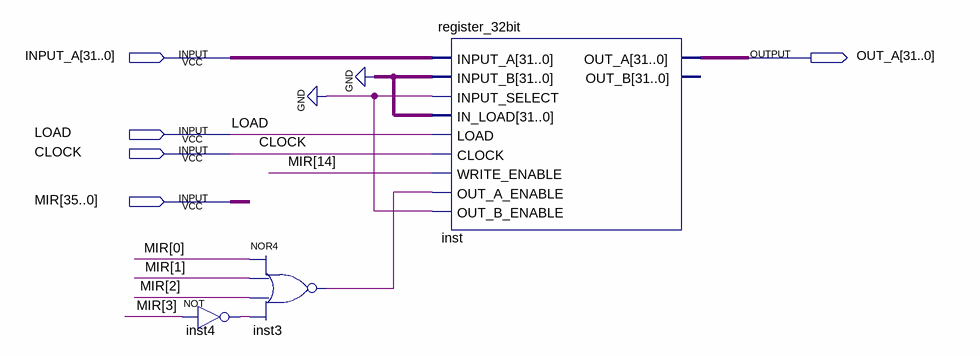
[diagram p0: schematic sheet]
// Quartus schematic OPC.bdf as structural Verilog: 3 symbols, 5 pins
module OPC (
  input  [31:0] INPUT_A,
  input  LOAD,
  input  CLOCK,
  input  [35:0] MIR,
  output [31:0] OUT_A
);

  wire inst3_out, inst4_out;

  not inst4 (inst4_out, MIR[3]);
  nor inst3 (inst3_out, MIR[0], MIR[1], MIR[2], inst4_out);
  register_32bit inst (
    .INPUT_A(INPUT_A), .INPUT_B({32{1'b0}}), .INPUT_SELECT(1'b0), .IN_LOAD({32{1'b0}}), .LOAD(LOAD),
    .CLOCK(CLOCK), .WRITE_ENABLE(MIR[14]), .OUT_A_ENABLE(inst3_out), .OUT_B_ENABLE(1'b0), .OUT_A(OUT_A));  // open: OUT_B
endmodule
